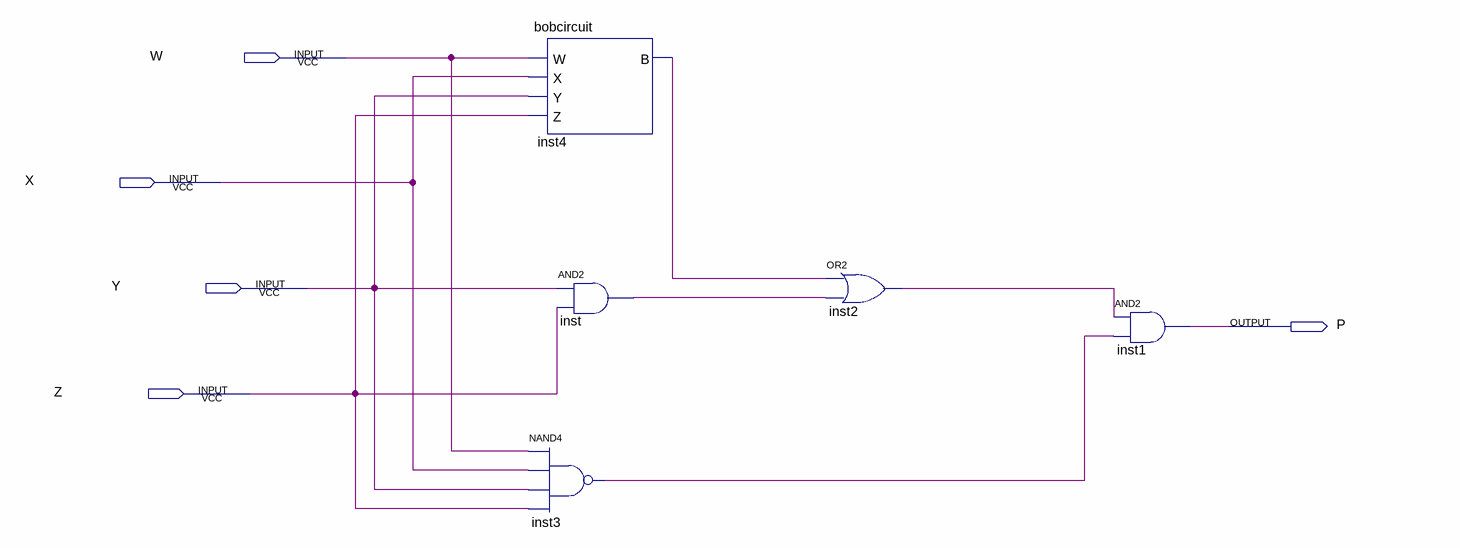
[diagram p0: schematic sheet]
// Quartus schematic newbob_circuit.bdf as structural Verilog: 5 symbols, 5 pins
module newbob_circuit (
  input  W,
  input  X,
  input  Y,
  input  Z,
  output P
);

  wire inst2_out, inst3_out, inst4_b, inst_out;

  bobcircuit inst4 (.W(W), .X(X), .Y(Y), .Z(Z), .B(inst4_b));
  and inst (inst_out, Y, Z);
  nand inst3 (inst3_out, W, X, Y, Z);
  or inst2 (inst2_out, inst4_b, inst_out);
  and inst1 (P, inst2_out, inst3_out);
endmodule
